# Altium project BMS_GEI_Corp.PrjPcb
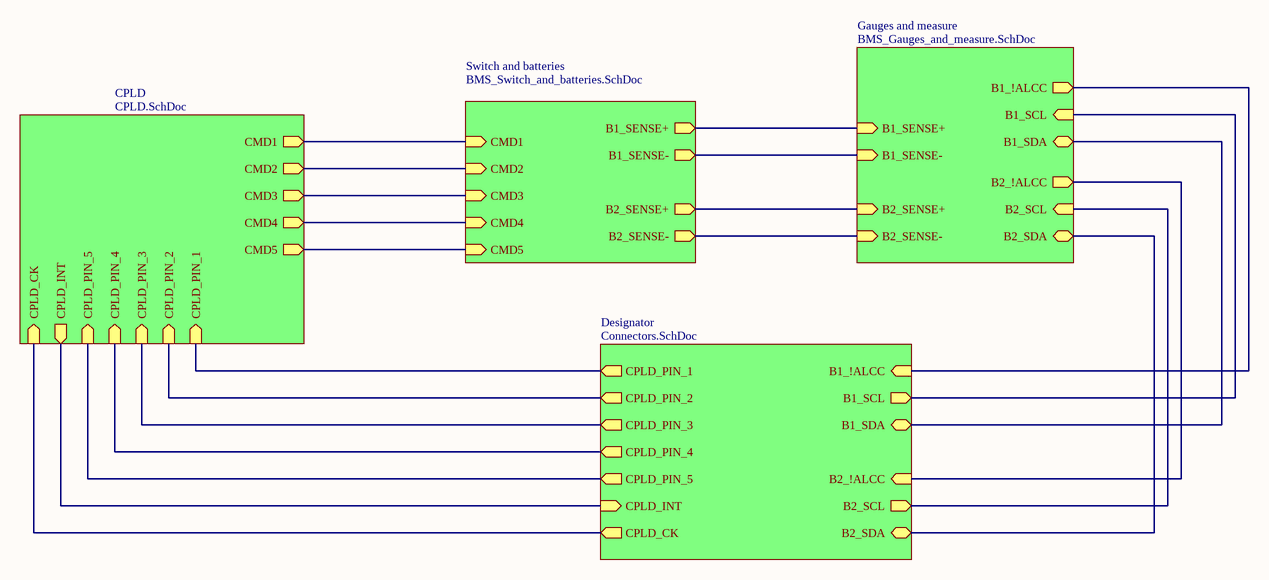
[diagram p0: BMS_AMain.SchDoc]
5 sheets, 70 parts. Net scope: hierarchical (ports join the sheet entries above them; power ports are global).
Board file: BMS2.PcbDoc
Sheets:
  BMS_AMain.SchDoc
    Switch and batteries = BMS_Switch_and_batteries.SchDoc
    Gauges and measure = BMS_Gauges_and_measure.SchDoc
    CPLD = CPLD.SchDoc
    Designator = Connectors.SchDoc

## Sheet BMS_AMain.SchDoc
size A4

### Sub-sheets
CPLD = CPLD.SchDoc: CMD1 (out), CMD2 (out), CMD3 (out), CMD4 (out), CMD5 (out), CPLD_INT (out), CPLD_PIN_1 (in), CPLD_PIN_2 (in), CPLD_PIN_4 (in), CPLD_PIN_3 (in), CPLD_PIN_5 (in), CPLD_CK (in)
Designator = Connectors.SchDoc: B1_SDA (bidir), B1_!ALCC (in), B2_!ALCC (in), B2_SCL (out), B1_SCL (out), B2_SDA (bidir), CPLD_PIN_3 (out), CPLD_PIN_1 (out), CPLD_PIN_4 (out), CPLD_PIN_2 (out), CPLD_INT (in), CPLD_PIN_5 (out), CPLD_CK (out)
Gauges and measure = BMS_Gauges_and_measure.SchDoc: B1_SENSE+ (in), B1_SENSE- (in), B2_SENSE+ (in), B2_SENSE- (in), B1_!ALCC (out), B1_SDA (bidir), B1_SCL (in), B2_!ALCC (out), B2_SDA (bidir), B2_SCL (in)
Switch and batteries = BMS_Switch_and_batteries.SchDoc: CMD1 (in), CMD2 (in), CMD3 (in), CMD5 (in), CMD4 (in), B1_SENSE- (out), B1_SENSE+ (out), B2_SENSE+ (out), B2_SENSE- (out)

### Nets
NetB1_1: sheet Switch and batteries/B1_SENSE-, sheet Gauges and measure/B1_SENSE-
NetB2_1: sheet Switch and batteries/B2_SENSE-, sheet Gauges and measure/B2_SENSE-
NetC5_1: sheet Switch and batteries/B1_SENSE+, sheet Gauges and measure/B1_SENSE+
NetC6_1: sheet Switch and batteries/B2_SENSE+, sheet Gauges and measure/B2_SENSE+
NetCON1_2: sheet CPLD/CPLD_CK, sheet Designator/CPLD_CK
NetCON1_3: sheet CPLD/CPLD_PIN_1, sheet Designator/CPLD_PIN_1
NetCON1_4: sheet CPLD/CPLD_PIN_2, sheet Designator/CPLD_PIN_2
NetCON1_5: sheet CPLD/CPLD_PIN_3, sheet Designator/CPLD_PIN_3
NetCON1_6: sheet CPLD/CPLD_PIN_4, sheet Designator/CPLD_PIN_4
NetCON1_7: sheet CPLD/CPLD_PIN_5, sheet Designator/CPLD_PIN_5
NetCON1_8: sheet CPLD/CPLD_INT, sheet Designator/CPLD_INT
NetCON1_9: sheet Gauges and measure/B1_SCL, sheet Designator/B1_SCL
NetCON1_11: sheet Gauges and measure/B1_!ALCC, sheet Designator/B1_!ALCC
NetCON1_12: sheet Gauges and measure/B1_SDA, sheet Designator/B1_SDA
NetCON1_13: sheet Gauges and measure/B2_!ALCC, sheet Designator/B2_!ALCC
NetCON1_14: sheet Gauges and measure/B2_SDA, sheet Designator/B2_SDA
NetCON1_15: sheet Gauges and measure/B2_SCL, sheet Designator/B2_SCL
NetR18_1: sheet Switch and batteries/CMD4, sheet CPLD/CMD4
NetR19_1: sheet Switch and batteries/CMD1, sheet CPLD/CMD1
NetR20_1: sheet Switch and batteries/CMD2, sheet CPLD/CMD2
NetR21_1: sheet Switch and batteries/CMD3, sheet CPLD/CMD3
NetR22_1: sheet Switch and batteries/CMD5, sheet CPLD/CMD5

### Notes on the sheet
- Title
- Size:
- Date:
- Battery Management System
- A4
- Number:
- Time:
- 1
- Revision:
- Author: GEI Corp
- V1.0
- GEI Corp
- 135 avenue de Rangueil
- INSA Toulouse
- 31400 Toulouse
- FRANCE
- File:
- Projet_Inter_1\BMS_GEI_CORP

## Sheet BMS_Switch_and_batteries.SchDoc
size A4
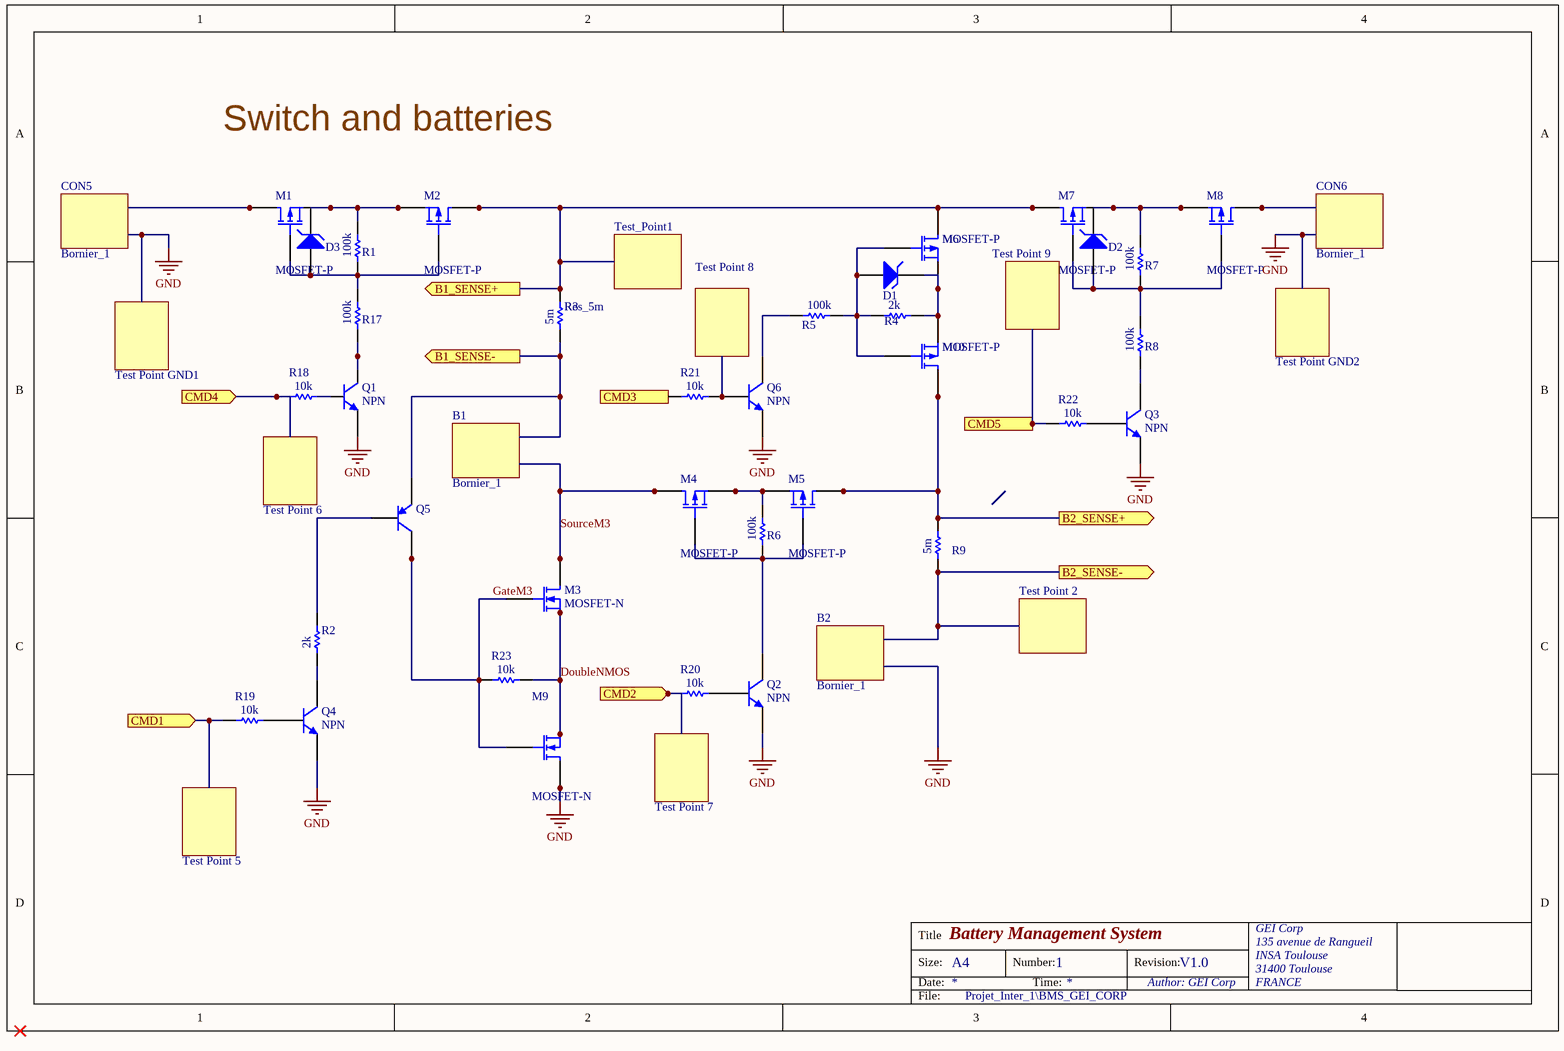
[diagram p1: BMS_Switch_and_batteries.SchDoc]

### Parts
B1  Bornier_1  [Block_2Position]
B2  Bornier_1  [Block_2Position]
CON5  Bornier_1  [Block_2Position]
CON6  Bornier_1  [Block_2Position]
D1  D Zener  [SOT95P230X110-3N_ZENER]  (value not drawn)
D2  D Zener  [SOT95P230X110-3N_ZENER]  (value not drawn)
D3  D Zener  [SOT95P230X110-3N_ZENER]  (value not drawn)
M1  MOSFET-P  [Vishay_S17-0173-SINGLE_MFG]
M2  MOSFET-P  [Vishay_S17-0173-SINGLE_MFG]
M3  MOSFET-N  [Vishay_S17-0173-SINGLE_MFG]
M4  MOSFET-P  [Vishay_S17-0173-SINGLE_MFG]
M5  MOSFET-P  [Vishay_S17-0173-SINGLE_MFG]
M6  MOSFET-P  [Vishay_S17-0173-SINGLE_MFG]
M7  MOSFET-P  [Vishay_S17-0173-SINGLE_MFG]
M8  MOSFET-P  [Vishay_S17-0173-SINGLE_MFG]
M9  MOSFET-N  [Vishay_S17-0173-SINGLE_MFG]
M10  MOSFET-P  [Vishay_S17-0173-SINGLE_MFG]
Q1  NPN  [SOT95P237X111-3N_NPN]
Q2  NPN  [SOT95P237X111-3N_NPN]
Q3  NPN  [SOT95P237X111-3N_NPN]
Q4  NPN  [SOT95P237X111-3N_NPN]
Q5  PNP  [SOT230P700X180-4N]  (value not drawn)
Q6  NPN  [SOT95P237X111-3N_NPN]
R1  Res_100k  [C0805]  (value not drawn)
R2  Res_2k  [C0805]  (value not drawn)
R3  Res_5m  [RES_WSHM2818_VIS-M]
R4  Res_2k  [C0805]  (value not drawn)
R5  Res_100k  [C0805]  (value not drawn)
R6  Res_100k  [C0805]  (value not drawn)
R7  Res_100k  [C0805]  (value not drawn)
R8  Res_100k  [C0805]  (value not drawn)
R9  Res_5m  [RES_WSHM2818_VIS-M]  (value not drawn)
R17  Res_100k  [C0805]  (value not drawn)
R18  Res_10k  [C0805]  (value not drawn)
R19  Res_10k  [C0805]  (value not drawn)
R20  Res_10k  [C0805]  (value not drawn)
R21  Res_10k  [C0805]  (value not drawn)
R22  Res_10k  [C0805]  (value not drawn)
R23  Res_10k  [C0805]  (value not drawn)
Test_Point1  Header_1  [PIN1]  (value not drawn)
Test_Point_2  Header_1  [PIN1]  (value not drawn)
Test_Point_5  Header_1  [PIN1]  (value not drawn)
Test_Point_6  Header_1  [PIN1]  (value not drawn)
Test_Point_7  Header_1  [PIN1]  (value not drawn)
Test_Point_8  Header_1  [PIN1]  (value not drawn)
Test_Point_9  Header_1  [PIN1]  (value not drawn)
Test_Point_GND1  Header_1  [PIN1]  (value not drawn)
Test_Point_GND2  Header_1  [PIN1]  (value not drawn)

### Ports
B1_SENSE+ (out), B1_SENSE- (out), B2_SENSE+ (out), B2_SENSE- (out), CMD1 (in), CMD2 (in), CMD3 (in), CMD4 (in), CMD5 (in)

### Nets
GND: B2.2 CON5.2 CON6.2 M9.5(D) M9.6(D) M9.7(D) M9.8(D) Q1.2(E) Q2.2(E) Q3.2(E) Q4.2(E) Q6.2(E) Test_Point_GND1.1 Test_Point_GND2.1
DoubleNMOS: M3.1(S) M3.2(S) M3.3(S) M9.1(S) M9.2(S) M9.3(S) R23.2
GateM3: M3.4(G) M9.4(G) Q5.2(C) Q5.4(C) R23.1
SourceM3: B1.2 M3.5(D) M3.6(D) M3.7(D) M3.8(D) M4.5(D) M4.6(D) M4.7(D) M4.8(D)
NetB1_1: B1.1 Q5.3(E) R3.1 ; port B1_SENSE-
NetB2_1: B2.1 R9.1 Test_Point_2.1 ; port B2_SENSE-
NetC5_1: M2.5(D) M2.6(D) M2.7(D) M2.8(D) M6.5(D) M6.6(D) M6.7(D) M6.8(D) M7.5(D) M7.6(D) M7.7(D) M7.8(D) R3.2 Test_Point1.1 ; port B1_SENSE+
NetC6_1: M5.5(D) M5.6(D) M5.7(D) M5.8(D) M10.5(D) M10.6(D) M10.7(D) M10.8(D) R9.2 ; port B2_SENSE+
NetCON5_1: CON5.1 M1.5(D) M1.6(D) M1.7(D) M1.8(D)
NetCON6_1: CON6.1 M8.5(D) M8.6(D) M8.7(D) M8.8(D)
NetD1_1: D1.1(A) M6.4(G) M10.4(G) R4.1 R5.2
NetD1_3: D1.3(K) M6.1(S) M6.2(S) M6.3(S) M10.1(S) M10.2(S) M10.3(S) R4.2
NetD2_1: D2.1(A) M7.4(G) M8.4(G) R7.1 R8.2
NetD2_3: D2.3(K) M7.1(S) M7.2(S) M7.3(S) M8.1(S) M8.2(S) M8.3(S) R7.2
NetD3_1: D3.1(A) M1.4(G) M2.4(G) R1.1 R17.2
NetD3_3: D3.3(K) M1.1(S) M1.2(S) M1.3(S) M2.1(S) M2.2(S) M2.3(S) R1.2
NetM4_1: M4.1(S) M4.2(S) M4.3(S) M5.1(S) M5.2(S) M5.3(S) R6.2
NetM4_4: M4.4(G) M5.4(G) Q2.3(C) R6.1
NetQ1_1: Q1.1(B) R18.2
NetQ1_3: Q1.3(C) R17.1
NetQ2_1: Q2.1(B) R20.2
NetQ3_1: Q3.1(B) R22.2
NetQ3_3: Q3.3(C) R8.1
NetQ4_1: Q4.1(B) R19.2
NetQ4_3: Q4.3(C) R2.1
NetQ5_1: Q5.1(B) R2.2
NetQ6_1: Q6.1(B) R21.2 Test_Point_8.1
NetQ6_3: Q6.3(C) R5.1
NetR18_1: R18.1 Test_Point_6.1 ; port CMD4
NetR19_1: R19.1 Test_Point_5.1 ; port CMD1
NetR20_1: R20.1 Test_Point_7.1 ; port CMD2
NetR21_1: R21.1 ; port CMD3
NetR22_1: R22.1 Test_Point_9.1 ; port CMD5

### Notes on the sheet
- Switch and batteries
- Title
- Size:
- Date:
- Battery Management System
- A4
- Number:
- Time:
- 1
- Revision:
- Author: GEI Corp
- V1.0
- GEI Corp
- 135 avenue de Rangueil
- INSA Toulouse
- 31400 Toulouse
- FRANCE
- File:
- Projet_Inter_1\BMS_GEI_CORP
- (in symbol Res_2k) 2k
- (in symbol Res_5m) 5m
- (in symbol Res_10k) 10k
- (in symbol Res_100k) 100k

### Library data of the parts
B1 B2 CON5 CON6 = Bornier_1: Bornier à vis
D1-D3 = D Zener: Zener Diode; Published: 8-Jun-2000; LatestRevisionDate: 17-Jul-2002; LatestRevisionNote: Re-released for DXP Platform.; PackageReference: DIODE-0.7; Publisher: Altium Limited; PackageDescription: Diode, Thru-Hole; 2 Leads; 0.7 in Pin Spacing
M1 M2 M4-M8 M10 = MOSFET-P: P-Channel MOSFET; Published: 8-Jun-2000; LatestRevisionDate: 17-Jul-2002; LatestRevisionNote: Re-released for DXP Platform.; PackageVersion: 1995/1996; PackageReference: E3; Publisher: Altium Limited; PackageDescription: TO, Flat Index; 3 In-Line, Axial Leads; Body Dia. 4.6mm; Lead Dia. 0.5 mm (max)
M3 M9 = MOSFET-N: N-Channel MOSFET; Published: 8-Jun-2000; LatestRevisionDate: 17-Jul-2002; LatestRevisionNote: Re-released for DXP Platform.; PackageVersion: 1995/1996; PackageReference: E3; Publisher: Altium Limited; PackageDescription: TO, Flat Index; 3 In-Line, Axial Leads; Body Dia. 4.6mm; Lead Dia. 0.5 mm (max)
Q1-Q4 Q6 = NPN: NPN Bipolar Transistor; Published: 8-Jun-2000; LatestRevisionDate: 17-Jul-2002; LatestRevisionNote: Re-released for DXP Platform.; PackageReference: TO-226-AA; Publisher: Altium Limited; PackageDescription: TO, Flat Index; 3 In-Line, Axial Leads; Body Dia. 4.8mm; Leads 0.55 x 0.51 mm (max); Code_JEDEC: TO-226-AA
Q5 = PNP: PNP Bipolar Transistor; Published: 8-Jun-2000; LatestRevisionDate: 29-May-2009; LatestRevisionNote: IPC-7351 Footprint Added.; PackageVersion: Aug-1999; PackageReference: SOT-23B; Publisher: Altium Limited; PackageDescription: 3-Pin SOT-23 Package 0.95 mm Pitch, 2.4 mm Lead Span
R1 R5-R8 R17 = Res_100k: Resistor
R2 R4 = Res_2k: Resistor
R3 R9 = Res_5m: Resistor
R18-R23 = Res_10k: Resistor
Test_Point1 Test_Point_2 Test_Point_5-Test_Point_9 Test_Point_GND1 Test_Point_GND2 = Header_1: Header 1-pin

## Sheet BMS_Gauges_and_measure.SchDoc
size A4
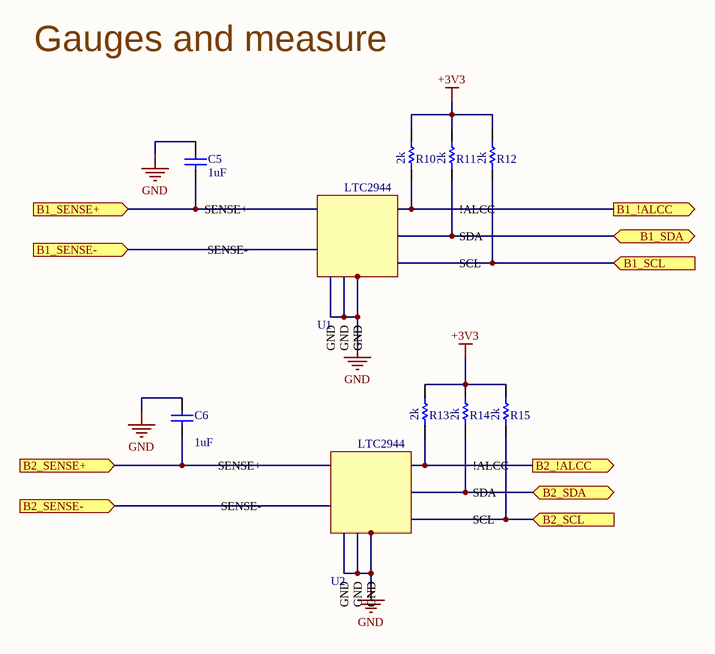
[diagram p2: BMS_Gauges_and_measure.SchDoc]

### Parts
C5  value 1uF  [C0805]  (hidden comment: Cap_1)
C6  value 1uF  [C0805]  (hidden comment: Cap_1)
R10  Res_2k  [C0805]  (value not drawn)
R11  Res_2k  [C0805]  (value not drawn)
R12  Res_2k  [C0805]  (value not drawn)
R13  Res_2k  [C0805]  (value not drawn)
R14  Res_2k  [C0805]  (value not drawn)
R15  Res_2k  [C0805]  (value not drawn)
U1  LTC2944  [DFN-8_DD_Gauges]  (value not drawn)
U2  LTC2944  [DFN-8_DD_Gauges]  (value not drawn)

### Ports
B1_!ALCC (out), B1_SCL (in), B1_SDA (bidir), B1_SENSE+ (in), B1_SENSE- (in), B2_!ALCC (out), B2_SCL (in), B2_SDA (bidir), B2_SENSE+ (in), B2_SENSE- (in)

### Nets
+3V3: R10.2 R11.2 R12.2 R13.2 R14.2 R15.2
GND: C5.2 C6.2 U1.2(GND) U1.3(GND) U1.7(GND) U1.9(GND) U2.2(GND) U2.3(GND) U2.7(GND) U2.9(GND)
NetB1_1: U1.8(SENSE-) ; port B1_SENSE-
NetB2_1: U2.8(SENSE-) ; port B2_SENSE-
NetC5_1: C5.1 U1.1(SENSE+) ; port B1_SENSE+
NetC6_1: C6.1 U2.1(SENSE+) ; port B2_SENSE+
NetCON1_9: R12.1 U1.4(SCL) ; port B1_SCL
NetCON1_11: R10.1 U1.6(!ALCC) ; port B1_!ALCC
NetCON1_12: R11.1 U1.5(SDA) ; port B1_SDA
NetCON1_13: R13.1 U2.6(!ALCC) ; port B2_!ALCC
NetCON1_14: R14.1 U2.5(SDA) ; port B2_SDA
NetCON1_15: R15.1 U2.4(SCL) ; port B2_SCL

### Notes on the sheet
- Gauges and measure
- Title
- Size:
- Date:
- Battery Management System
- A4
- Number:
- Time:
- 1
- Revision:
- Author: GEI Corp
- V1.0
- GEI Corp
- 135 avenue de Rangueil
- INSA Toulouse
- 31400 Toulouse
- FRANCE
- File:
- Projet_Inter_1\BMS_GEI_CORP
- (in symbol Res_2k) 2k

### Library data of the parts
C5 C6 = Cap_1: Capacitor; Published: 8-Jun-2000; LatestRevisionDate: 17-Jul-2002; LatestRevisionNote: Re-released for DXP Platform.; PackageReference: RAD-0.3; Publisher: Altium Limited; PackageDescription: Radial Cap, Thru-Hole; 2 Leads; 0.3 in Pin Spacing
R10-R15 = Res_2k: Resistor
U1 U2 = LTC2944: Gas gauge

## Sheet CPLD.SchDoc
size A4
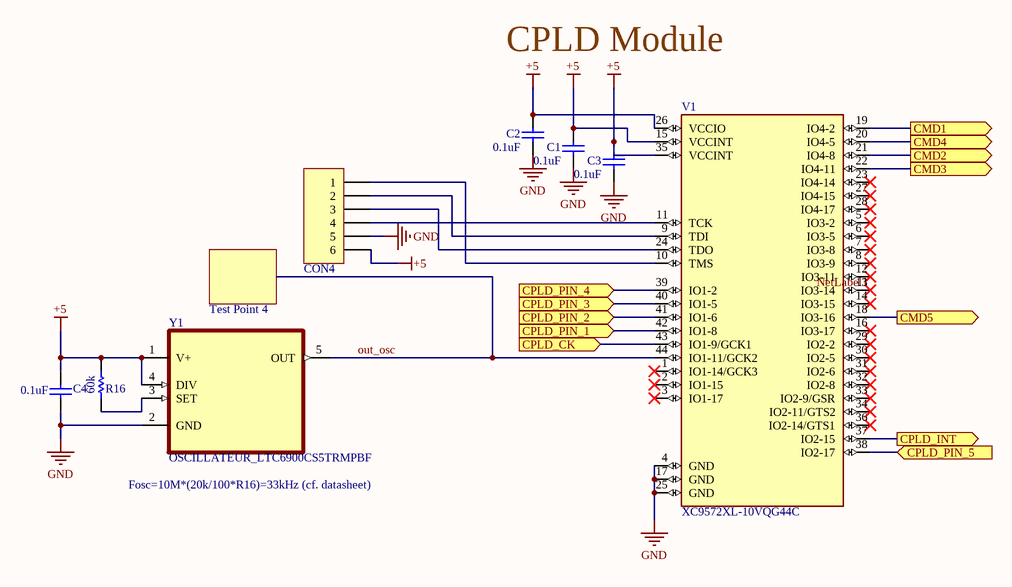
[diagram p3: CPLD.SchDoc]

### Parts
C1  value 0.1uF  [C0805]  (hidden comment: Cap_0.1u)
C2  value 0.1uF  [C0805]  (hidden comment: Cap_0.1u)
C3  value 0.1uF  [C0805]  (hidden comment: Cap_0.1u)
C4  value 0.1uF  [C0805]  (hidden comment: Cap_0.1u)
CON4  Header 6  [HDR1X6]  (value not drawn)
R16  Res_60k  [C0805]  (value not drawn)
Test_Point_4  Header_1  [PIN1]  (value not drawn)
V1  XC9572XL-10VQG44C  [VQFP-44_CPLD]
Y1  OSCILLATEUR_LTC6900CS5TRMPBF  [SOT95P280X100-5N_OSC]

### Ports
CMD1 (out), CMD2 (out), CMD3 (out), CMD4 (out), CMD5 (out), CPLD_CK (in), CPLD_INT (out), CPLD_PIN_1 (in), CPLD_PIN_2 (in), CPLD_PIN_3 (in), CPLD_PIN_4 (in), CPLD_PIN_5 (in)

### Nets
+5: C1.2 C2.2 C3.2 C4.2 CON4.6 R16.2 V1.15(VCCINT) V1.26(VCCIO) V1.35(VCCINT) Y1.1(V+) Y1.4(DIV)
GND: C1.1 C2.1 C3.1 C4.1 CON4.5 V1.4(GND) V1.17(GND) V1.25(GND) Y1.2(GND)
out_osc: Test_Point_4.1 V1.44(IO1-11/GCK2) Y1.5(OUT)
NetCON1_2: V1.43(IO1-9/GCK1) ; port CPLD_CK
NetCON1_3: V1.42(IO1-8) ; port CPLD_PIN_1
NetCON1_4: V1.41(IO1-6) ; port CPLD_PIN_2
NetCON1_5: V1.40(IO1-5) ; port CPLD_PIN_3
NetCON1_6: V1.39(IO1-2) ; port CPLD_PIN_4
NetCON1_7: V1.38(IO2-17) ; port CPLD_PIN_5
NetCON1_8: V1.37(IO2-15) ; port CPLD_INT
NetCON4_1: CON4.1 V1.10(TMS)
NetCON4_2: CON4.2 V1.9(TDI)
NetCON4_3: CON4.3 V1.24(TDO)
NetCON4_4: CON4.4 V1.11(TCK)
NetR16_1: R16.1 Y1.3(SET)
NetR18_1: V1.20(IO4-5) ; port CMD4
NetR19_1: V1.19(IO4-2) ; port CMD1
NetR20_1: V1.21(IO4-8) ; port CMD2
NetR21_1: V1.22(IO4-11) ; port CMD3
NetR22_1: V1.18(IO3-16) ; port CMD5

Not connected (* = marked no-connect by the designer): V1 1(IO1-14/GCK3)* 2(IO1-15)* 3(IO1-17)* 5(IO3-2)* 6(IO3-5)* 7(IO3-8)* 8(IO3-9)* 12(IO3-11)* 13(IO3-14)* 14(IO3-15)* 16(IO3-17)* 23(IO4-14)* 27(IO4-15)* 28(IO4-17)* 29(IO2-2)* 30(IO2-5)* 31(IO2-6)* 32(IO2-8)* 33(IO2-9/GSR)* 34(IO2-11/GTS2)* 36(IO2-14/GTS1)*

### Notes on the sheet
- CPLD Module
- Fosc=10M*(20k/100*R16)=33kHz (cf. datasheet)
- Labels drawn without touching a wire or pin: NetLabel1
- Title
- Size:
- Date:
- Battery Management System
- A4
- Number:
- Time:
- 1
- Revision:
- Author: GEI Corp
- V1.0
- GEI Corp
- 135 avenue de Rangueil
- INSA Toulouse
- 31400 Toulouse
- FRANCE
- File:
- Projet_Inter_1\BMS_GEI_CORP
- (in symbol Res_60k) 60k

### Library data of the parts
C1-C4 = Cap_0.1u: Capacitor; Published: 8-Jun-2000; LatestRevisionDate: 17-Jul-2002; LatestRevisionNote: Re-released for DXP Platform.; PackageReference: RAD-0.3; Publisher: Altium Limited; PackageDescription: Radial Cap, Thru-Hole; 2 Leads; 0.3 in Pin Spacing
CON4 = Header 6: Header, 6-Pin; LatestRevisionDate: 17-Jul-2002; LatestRevisionNote: Re-released for DXP Platform.; Publisher: Altium Limited
R16 = Res_60k: Resistor
Test_Point_4 = Header_1: Header 1-pin
V1 = XC9572XL-10VQG44C: IC CPLD 72MC 10NS 44VQFP; MF: Xilinx Inc.; Value: *; MP: XC9572XL-10VQG44C; Package: VQFP-44 Xilinx; Availability: Warning; SnapEDA_Link: https://www.snapeda.com/parts/XC9572XL-10VQG44C/Xilinx%20Inc./view-part/51416/?ref=snap; Price: None; Purchase-URL: https://pricing.snapeda.com/search/part/XC9572XL-10VQG44C/?ref=eda; Check_prices: https://www.snapeda.com/parts/XC9572XL-10VQG44C/Xilinx%20Inc./view-part/51416/?ref=eda
Y1 = OSCILLATEUR_LTC6900CS5TRMPBF: Low Power, 1kHz to 20MHz Resistor Set SOT-23 Oscillator; Package: None; Price: None; Value: *; MP: LTC6900CS5TRMPBF; Availability: Unavailable

## Sheet Connectors.SchDoc
size A4
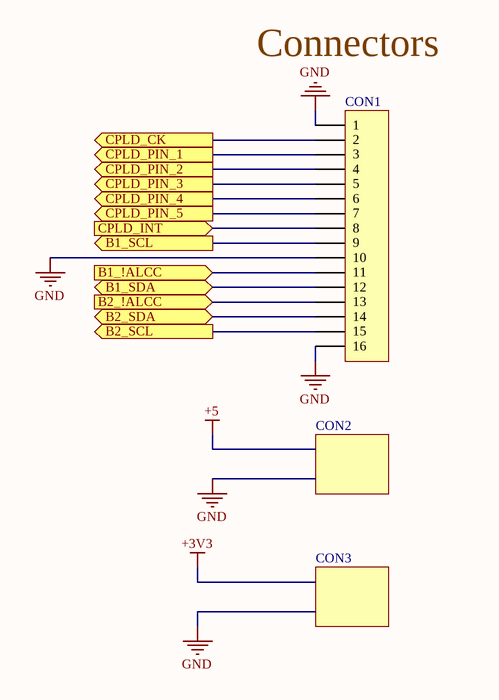
[diagram p4: Connectors.SchDoc]

### Parts
CON1  Header 16  [HDR1X16]  (value not drawn)
CON2  Bornier_1  [Block_2Position]  (value not drawn)
CON3  Bornier_1  [Block_2Position]  (value not drawn)

### Ports
B1_!ALCC (in), B1_SCL (out), B1_SDA (bidir), B2_!ALCC (in), B2_SCL (out), B2_SDA (bidir), CPLD_CK (out), CPLD_INT (in), CPLD_PIN_1 (out), CPLD_PIN_2 (out), CPLD_PIN_3 (out), CPLD_PIN_4 (out), CPLD_PIN_5 (out)

### Nets
+3V3: CON3.1
+5: CON2.1
GND: CON1.1 CON1.10 CON1.16 CON2.2 CON3.2
NetCON1_2: CON1.2 ; port CPLD_CK
NetCON1_3: CON1.3 ; port CPLD_PIN_1
NetCON1_4: CON1.4 ; port CPLD_PIN_2
NetCON1_5: CON1.5 ; port CPLD_PIN_3
NetCON1_6: CON1.6 ; port CPLD_PIN_4
NetCON1_7: CON1.7 ; port CPLD_PIN_5
NetCON1_8: CON1.8 ; port CPLD_INT
NetCON1_9: CON1.9 ; port B1_SCL
NetCON1_11: CON1.11 ; port B1_!ALCC
NetCON1_12: CON1.12 ; port B1_SDA
NetCON1_13: CON1.13 ; port B2_!ALCC
NetCON1_14: CON1.14 ; port B2_SDA
NetCON1_15: CON1.15 ; port B2_SCL

### Notes on the sheet
- Connectors
- Title
- Size:
- Date:
- Battery Management System
- A4
- Number:
- Time:
- 1
- Revision:
- Author: GEI Corp
- V1.0
- GEI Corp
- 135 avenue de Rangueil
- INSA Toulouse
- 31400 Toulouse
- FRANCE
- File:
- Projet_Inter_1\BMS_GEI_CORP

### Library data of the parts
CON1 = Header 16: Header, 16-Pin; LatestRevisionDate: 17-Jul-2002; LatestRevisionNote: Re-released for DXP Platform.; Publisher: Altium Limited
CON2 CON3 = Bornier_1: Bornier à vis

## Nets that join several sheets
+3V3: BMS_Gauges_and_measure (6 pins), Connectors (CON3.1)
+5: CPLD (11 pins), Connectors (CON2.1)
GND: BMS_Switch_and_batteries (14 pins), BMS_Gauges_and_measure (10 pins), CPLD (9 pins), Connectors (5 pins)
NetB1_1: BMS_Switch_and_batteries (B1.1 Q5.3 R3.1), BMS_Gauges_and_measure (U1.8)
NetB2_1: BMS_Switch_and_batteries (B2.1 R9.1 Test_Point_2.1), BMS_Gauges_and_measure (U2.8)
NetC5_1: BMS_Switch_and_batteries (14 pins), BMS_Gauges_and_measure (C5.1 U1.1)
NetC6_1: BMS_Switch_and_batteries (9 pins), BMS_Gauges_and_measure (C6.1 U2.1)
NetCON1_2: CPLD (V1.43), Connectors (CON1.2)
NetCON1_3: CPLD (V1.42), Connectors (CON1.3)
NetCON1_4: CPLD (V1.41), Connectors (CON1.4)
NetCON1_5: CPLD (V1.40), Connectors (CON1.5)
NetCON1_6: CPLD (V1.39), Connectors (CON1.6)
NetCON1_7: CPLD (V1.38), Connectors (CON1.7)
NetCON1_8: CPLD (V1.37), Connectors (CON1.8)
NetCON1_9: BMS_Gauges_and_measure (R12.1 U1.4), Connectors (CON1.9)
NetCON1_11: BMS_Gauges_and_measure (R10.1 U1.6), Connectors (CON1.11)
NetCON1_12: BMS_Gauges_and_measure (R11.1 U1.5), Connectors (CON1.12)
NetCON1_13: BMS_Gauges_and_measure (R13.1 U2.6), Connectors (CON1.13)
NetCON1_14: BMS_Gauges_and_measure (R14.1 U2.5), Connectors (CON1.14)
NetCON1_15: BMS_Gauges_and_measure (R15.1 U2.4), Connectors (CON1.15)
NetR18_1: BMS_Switch_and_batteries (R18.1 Test_Point_6.1), CPLD (V1.20)
NetR19_1: BMS_Switch_and_batteries (R19.1 Test_Point_5.1), CPLD (V1.19)
NetR20_1: BMS_Switch_and_batteries (R20.1 Test_Point_7.1), CPLD (V1.21)
NetR21_1: BMS_Switch_and_batteries (R21.1), CPLD (V1.22)
NetR22_1: BMS_Switch_and_batteries (R22.1 Test_Point_9.1), CPLD (V1.18)